# Altium schematic sheet DEBUG_CONN.SchDoc
size A; SheetNumber: 16; SheetTotal: 16
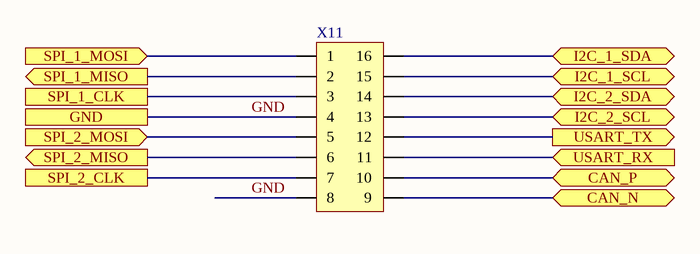
[diagram p0: DEBUG_CONN.SchDoc]

## Parts
X11  (no value)  [2x8PinHeader_0.1in]

## Ports
CAN_N (bidir), CAN_P (bidir), GND, I2C_1_SCL (bidir), I2C_1_SDA (bidir), I2C_2_SCL (bidir), I2C_2_SDA (bidir), SPI_1_CLK, SPI_1_MISO (out), SPI_1_MOSI (in), SPI_2_CLK, SPI_2_MISO (out), SPI_2_MOSI (in), USART_RX (in), USART_TX (out)

## Nets
CAN_N: X11.9 ; port CAN_N
CAN_P: X11.10 ; port CAN_P
GND: X11.4 X11.8 ; port GND
I2C_1_SCL: X11.15 ; port I2C_1_SCL
I2C_1_SDA: X11.16 ; port I2C_1_SDA
I2C_2_SCL: X11.13 ; port I2C_2_SCL
I2C_2_SDA: X11.14 ; port I2C_2_SDA
SPI_1_CLK: X11.3 ; port SPI_1_CLK
SPI_1_MISO: X11.2 ; port SPI_1_MISO
SPI_1_MOSI: X11.1 ; port SPI_1_MOSI
SPI_2_CLK: X11.7 ; port SPI_2_CLK
SPI_2_MISO: X11.6 ; port SPI_2_MISO
SPI_2_MOSI: X11.5 ; port SPI_2_MOSI
USART_RX: X11.11 ; port USART_RX
USART_TX: X11.12 ; port USART_TX

## Library data of the parts
X11 = 2x8_0.1in: Generic 2x8 0.1in pitch pin header